# Altium schematic sheet 2.4.SchDoc
size A4
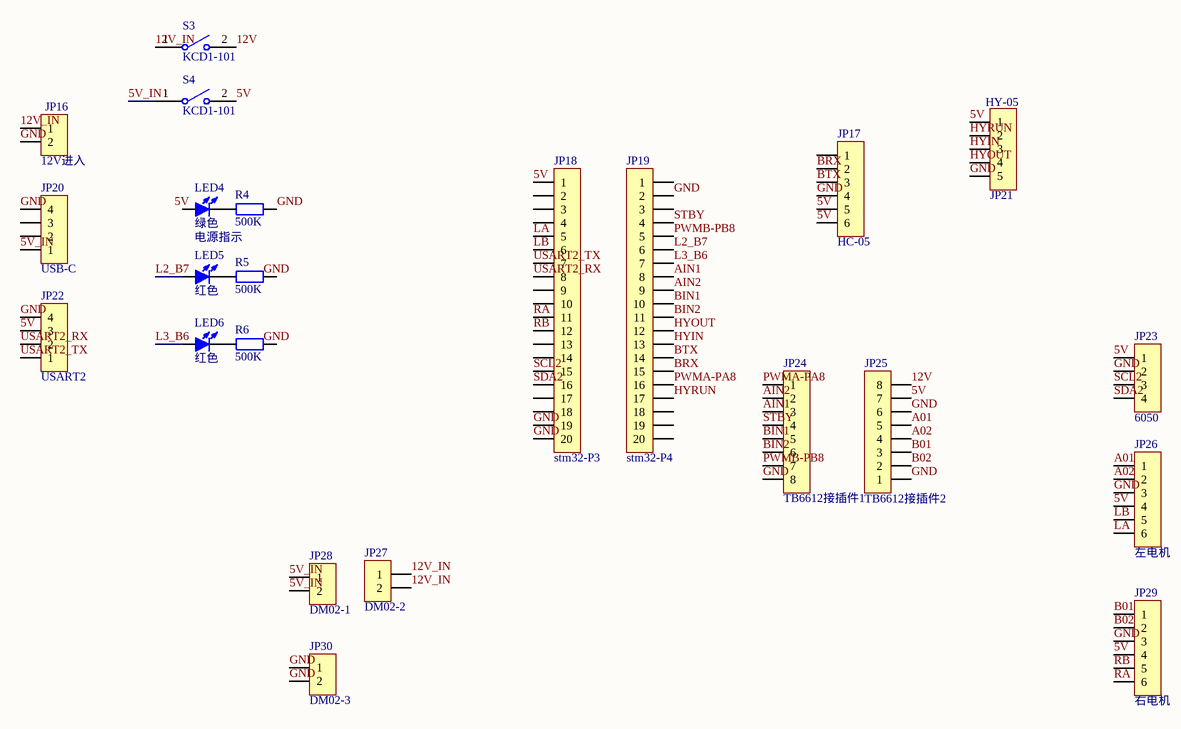
[diagram p0: 2.4.SchDoc]

## Parts
JP16  BOM名称: 12V进入  [KF2EDGK5.08-LI-2P]  (hidden comment: HDR-1X2)
JP17  HC-05  [HDR2.54-M-LI-6P]
JP18  BOM名称: stm32-P3  [HDR2.54-M-LI-20P]  (hidden comment: HDR-1X20)
JP19  BOM名称: stm32-P4  [HDR2.54-M-LI-20P]  (hidden comment: HDR-1X20)
JP20  BOM名称: USB-C  [HDR2.54-M-LI-4P]  (hidden comment: HDR-1X4)
JP21  HY-05  [HDR2.54-M-LI-5P]
JP22  BOM名称: USART2  [HDR2.54-M-LI-4P]  (hidden comment: HDR-1X4)
JP23  BOM名称: 6050  [HDR2.54-M-LI-4P]  (hidden comment: HDR-1X4)
JP24  BOM名称: TB6612接插件1  [HDR2.54-M-LI-8P]  (hidden comment: HDR-1X8)
JP25  BOM名称: TB6612接插件2  [HDR2.54-M-LI-8P]  (hidden comment: HDR-1X8)
JP26  BOM名称: 左电机  [KF128-5.08-6P]  (hidden comment: HDR-1X6)
JP27  BOM名称: DM02-2  [HDR2.54-M-LI-2P]  (hidden comment: HDR-1X2)
JP28  BOM名称: DM02-1  [HDR2.54-M-LI-2P]  (hidden comment: HDR-1X2)
JP29  BOM名称: 右电机  [KF128-5.08-6P]  (hidden comment: HDR-1X6)
JP30  BOM名称: DM02-3  [HDR2.54-M-LI-2P]  (hidden comment: HDR-1X2)
LED4  绿色  BOM名称: 电源指示  [LED 0805G]
LED5  红色  [LED 0805G]
LED6  红色  [LED 0805G]
R4  500K  [R 0805_M]
R5  500K  [R 0805_M]
R6  500K  [R 0805_M]
S3  KCD1-101  [KCD1-101]
S4  KCD1-101  [KCD1-101]

## Nets
5V: JP17.5 JP17.6 JP18.1 JP21.1 JP22.3 JP23.1 JP25.7 JP26.4 JP29.4 LED4.1(A) S4.2
5V_IN: JP20.1 JP28.1 JP28.2 S4.1
12V: JP25.8 S3.2
12V_IN: JP16.1 JP27.1 JP27.2 S3.1
A01: JP25.5 JP26.1
A02: JP25.4 JP26.2
AIN1: JP19.8 JP24.3
AIN2: JP19.9 JP24.2
B01: JP25.3 JP29.1
B02: JP25.2 JP29.2
BIN1: JP19.10 JP24.5
BIN2: JP19.11 JP24.6
BRX: JP17.2 JP19.15
BTX: JP17.3 JP19.14
GND: JP16.2 JP17.4 JP18.19 JP18.20 JP19.2 JP20.4 JP21.5 JP22.4 JP23.2 JP24.8 JP25.1 JP25.6 JP26.3 JP29.3 JP30.1 JP30.2 R4.2 R5.2 R6.2
HYIN: JP19.13 JP21.3
HYOUT: JP19.12 JP21.4
HYRUN: JP19.17 JP21.2
L2_B7: JP19.6 LED5.1(A)
L3_B6: JP19.7 LED6.1(A)
LA: JP18.5 JP26.6
LB: JP18.6 JP26.5
PWMA-PA8: JP19.16 JP24.1
PWMB-PB8: JP19.5 JP24.7
RA: JP18.11 JP29.6
RB: JP18.12 JP29.5
SCL2: JP18.15 JP23.3
SDA2: JP18.16 JP23.4
STBY: JP19.4 JP24.4
USART2_RX: JP18.8 JP22.2
USART2_TX: JP18.7 JP22.1
NetLED4_2: LED4.2(K) R4.1
NetLED5_2: LED5.2(K) R5.1
NetLED6_2: LED6.2(K) R6.1

Not connected (* = marked no-connect by the designer): JP17 1; JP18 2 3 4 9 10 13 14 17 18; JP19 1 3 18 19 20; JP20 2 3

## Library data of the parts
JP16 = Header 2: 2P接插件; 版权归属: 源创客; 学习资源: www.ooocke.com
JP17 = Header 6: 6P接插件; 版权归属: 封装库来自淘宝 ID：黄晶宝石; BOM名称: HC-05; 学习资源: https://shop463601444.taobao.com
JP18 JP19 = Header 20: 20P接插件; 版权归属: 封装库来自淘宝 ID：黄晶宝石; 学习资源: https://shop463601444.taobao.com
JP20 JP22 JP23 = Header 4: 4P接插件; 版权归属: 封装库来自淘宝 ID：黄晶宝石; 学习资源: https://shop463601444.taobao.com
JP21 = Header 5: 5P接插件; 版权归属: 封装库来自淘宝 ID：黄晶宝石; BOM名称: 5P接插件; 学习资源: https://shop463601444.taobao.com
JP24 JP25 = Header 8: 8P接插件; 版权归属: 封装库来自淘宝 ID：黄晶宝石; 学习资源: https://shop463601444.taobao.com
JP26 JP29 = Header 6: 6P接插件; 版权归属: 源创客; 学习资源: www.ooocke.com
JP27 JP28 JP30 = Header 2: 2P接插件; 版权归属: 封装库来自淘宝 ID：黄晶宝石; 联系售后: https://shop463601444.taobao.com
LED4-LED6 = LED-SMD: 贴片LED; 版权归属: 源创客; 学习资源: www.ooocke.com
  LED5 LED6: BOM名称: 贴片LED
R4-R6 = R: 贴片电阻; 版权归属: 来自淘宝 ID：黄晶宝石; BOM名称: 贴片电阻; 联系售后: https://shop463601444.taobao.com
  R5: ComponentLink1Description: New link; ComponentLink1URL: *
S3 S4 = KCD1-101: 1路单刀船型开关; 版权归属: 封装库来自淘宝 ID：黄晶宝石; BOM名称: 1路单刀船型开关; 学习资源: www.ooocke.com